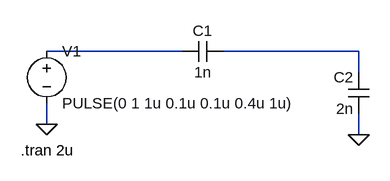
[diagram p0: schematic quiz_q14.asc]
quiz_q14.asc, the LTspice schematic file:
Version 4
SHEET 1 880 680
WIRE 336 80 128 80
WIRE 608 80 400 80
WIRE 608 112 608 80
WIRE 128 192 128 160
WIRE 608 208 608 176
FLAG 128 192 0
FLAG 608 208 0
SYMBOL cap 400 64 R90
WINDOW 0 0 32 VBottom 2
WINDOW 3 32 32 VTop 2
SYMATTR InstName C1
SYMATTR Value 1n
SYMBOL cap 624 176 R180
WINDOW 0 24 56 Left 2
WINDOW 3 24 8 Left 2
SYMATTR InstName C2
SYMATTR Value 2n
SYMBOL voltage 128 64 R0
WINDOW 123 0 0 Left 0
WINDOW 39 0 0 Left 0
SYMATTR InstName V1
SYMATTR Value PULSE(0 1 1u 0.1u 0.1u 0.4u 1u)
TEXT 88 232 Left 2 !.tran 2u

The netlist it stands for:
* quiz_q14.asc
C1 N002 N001 1n
C2 0 N002 2n
V1 N001 0 PULSE(0 1 1u 0.1u 0.1u 0.4u 1u)
.tran 2u
.backanno
.end